# EAGLE schematic DP-webplatformv1.1 (EAGLE 5.06)
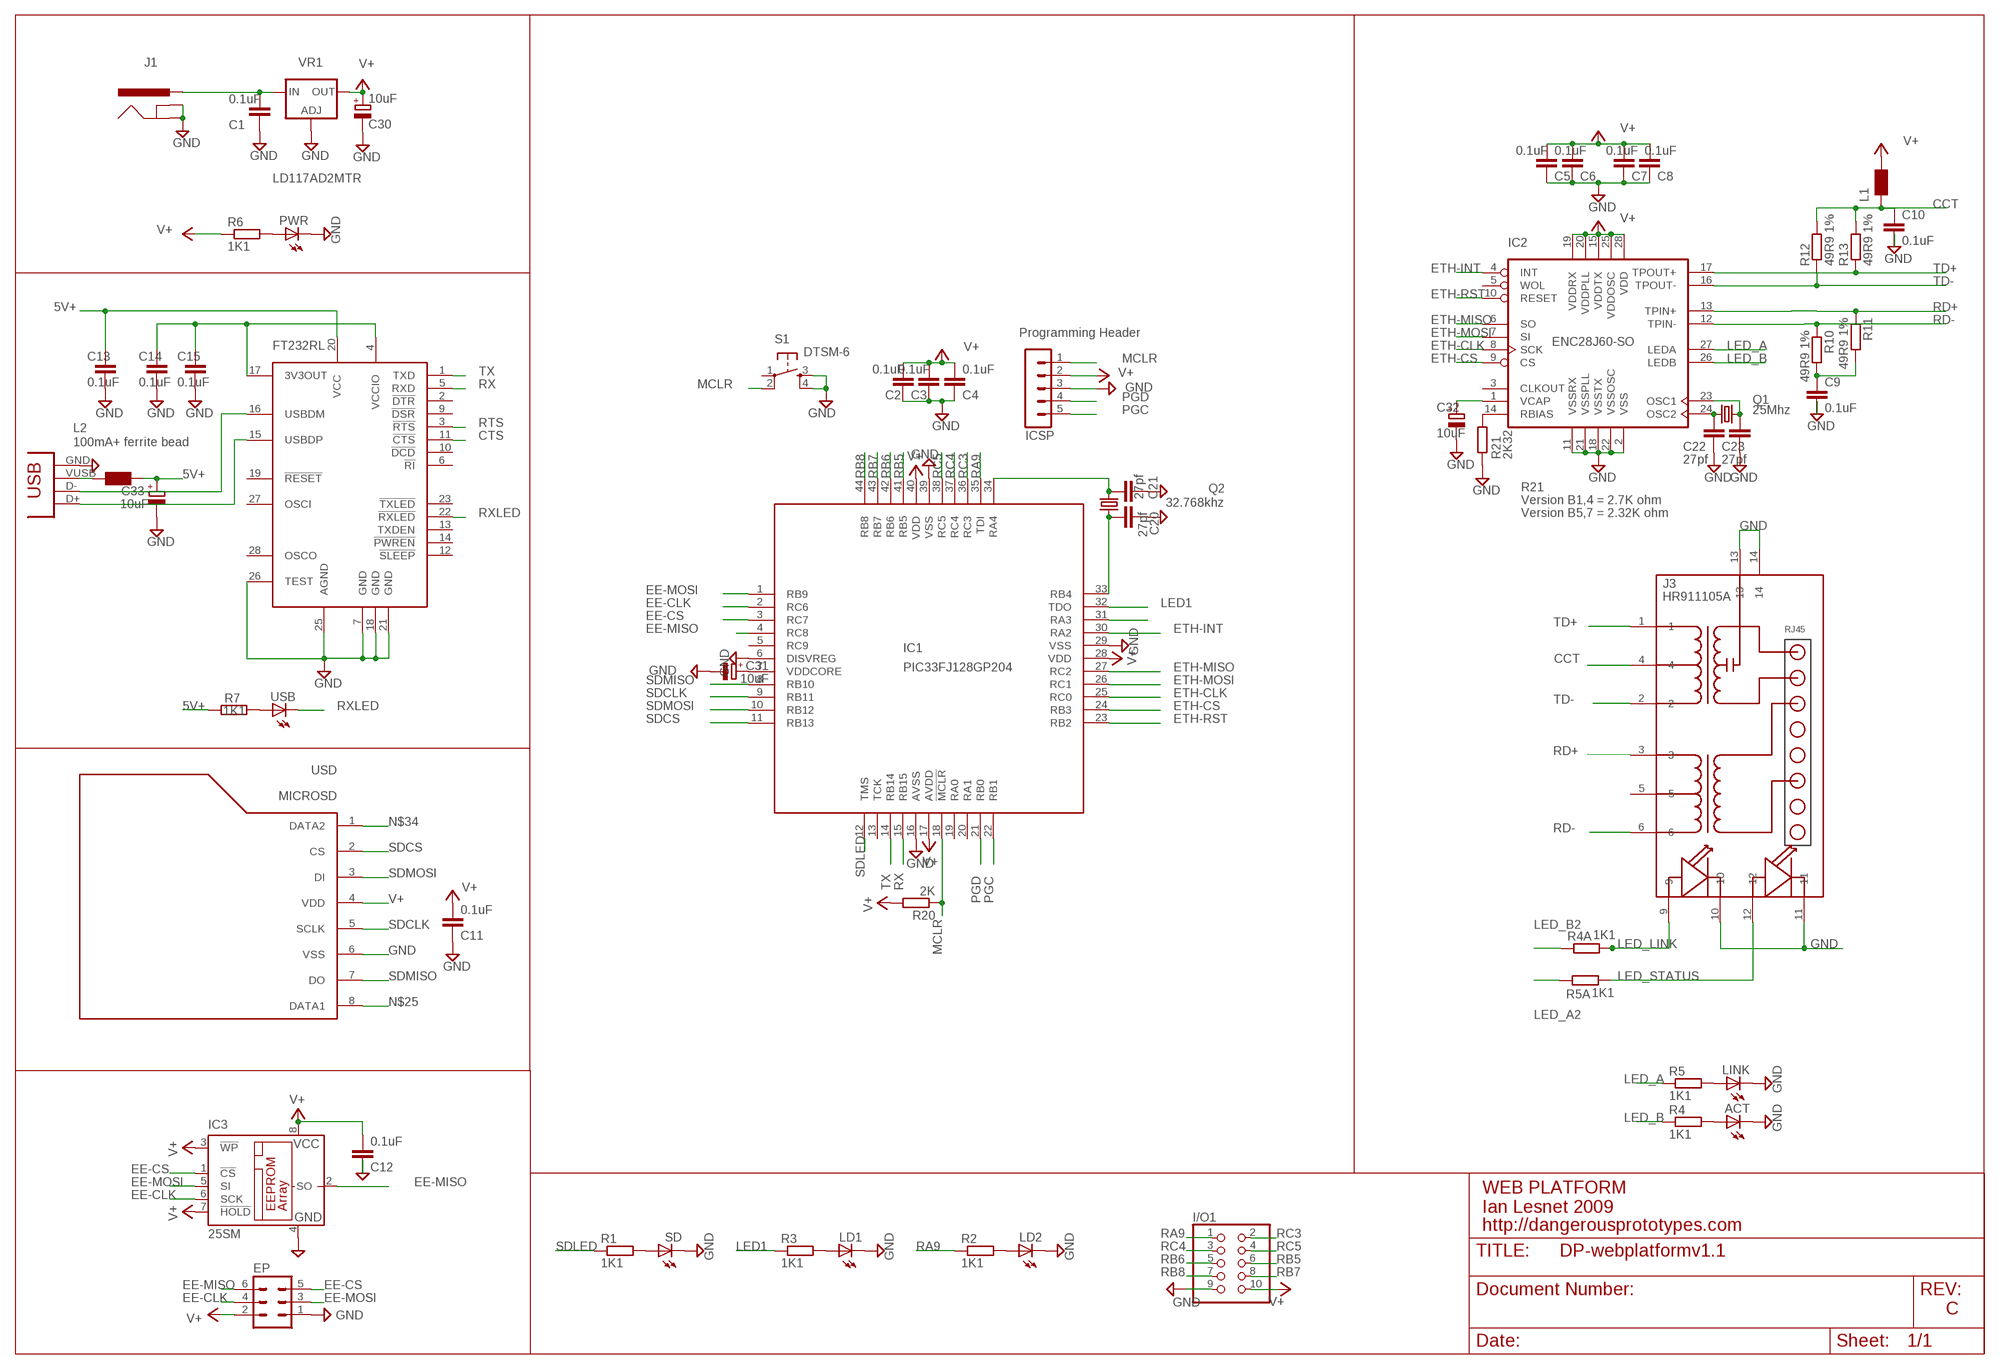
[diagram p0: schematic, sheet 1]

## Parts
ACT  LEDCHIPLED_0805  [CHIPLED_0805]
C1  0.1uF  C-EUC0805  [C0805]
C2  0.1uF  C-EUC0805  [C0805]
C3  0.1uF  C-EUC0805  [C0805]
C4  0.1uF  C-EUC0805  [C0805]
C5  0.1uF  C-EUC0805  [C0805]
C6  0.1uF  C-EUC0805  [C0805]
C7  0.1uF  C-EUC0805  [C0805]
C8  0.1uF  C-EUC0805  [C0805]
C9  0.1uF  C-EUC0805  [C0805]
C10  0.1uF  C-EUC0805  [C0805]
C11  0.1uF  C-EUC0805  [C0805]
C12  0.1uF  C-EUC0805  [C0805]
C13  0.1uF  C-EUC0805  [C0805]
C14  0.1uF  C-EUC0805  [C0805]
C15  0.1uF  C-EUC0805  [C0805]
C20  27pf  C-EUC0805  [C0805]
C21  27pf  C-EUC0805  [C0805]
C22  27pf  C-EUC0805  [C0805]
C23  27pf  C-EUC0805  [C0805]
C30  10uF  CPOL-EUSMCA  [SMC_A]
C31  10uF  CPOL-EUSMCA  [SMC_A]
C32  10uF  CPOL-EUSMCA  [SMC_A]
C33  10uF  CPOL-EUSMCA  [SMC_A]
CONN1  CONN_USB  [CONN_USB_MINI-B]
EP  MA03-2  [MA03-2]
I/O1  PINHD-2X5  [2X05]
IC1  PIC33FJ128GP204  PIC24FJ64GA004  [TQFP44]
IC2  ENC28J60-SO  [SO28W]
IC3  25SM  [SO-08M]
IC4  FT232RL  [SSOP28]
ICSP  MA05-1  [MA05-1]
J1  POWER_JACKSMD  [POWER_JACK_SMD]
J3  HR911105A  [HR911105A]
L1  WE-KIL_0805  [WE-KI_0805_B]
L2  100mA+ ferrite bead  WE-KIL_0805  [WE-KI_0805_B]
LD1  LEDCHIPLED_0805  [CHIPLED_0805]
LD2  LEDCHIPLED_0805  [CHIPLED_0805]
LINK  LEDCHIPLED_0805  [CHIPLED_0805]
PWR  LEDCHIPLED_0805  [CHIPLED_0805]
Q1  25Mhz  CRYSTALHC49UP  [HC49UP]
Q2  32.768khz  CRYSTALMM20SS  [MM20SS]
R1  1K1  R-EU_R0805  [R0805]
R2  1K1  R-EU_R0805  [R0805]
R3  1K1  R-EU_R0805  [R0805]
R4  1K1  R-EU_R0805  [R0805]
R4A  1K1  R-EU_R0805  [R0805]
R5  1K1  R-EU_R0805  [R0805]
R5A  1K1  R-EU_R0805  [R0805]
R6  1K1  R-EU_R0805  [R0805]
R7  1K1  R-EU_M0805  [M0805]
R10  49R9 1%  R-EU_R0805  [R0805]
R11  49R9 1%  R-EU_R0805  [R0805]
R12  49R9 1%  R-EU_R0805  [R0805]
R13  49R9 1%  R-EU_R0805  [R0805]
R20  2K  R-EU_R0805  [R0805]
R21  2K32  R-EU_R0805  [R0805]
S1  DTSM-6  [LSH43]
SD  LEDCHIPLED_0805  [CHIPLED_0805]
USB  LEDCHIP-LED0805  [CHIP-LED0805]
USD  MICROSD  [MICROSD]
VR1  LD117AD2MTR  [D2PACK]

## Nets
5V+: C13.1 C33.+ IC4.20(VCC) L2.1 R7.2
$N26: CONN1.VUSB L2.2
CCT: C10.1 J3.4 L1.2 R12.2 R13.2
CTS: IC4.11(!CTS)
EE-CLK: EP.4 IC1.2(RC6) IC3.6(SCK)
EE-CS: EP.5 IC1.3(RC7) IC3.1(!CS)
EE-MISO: EP.6 IC1.4(RC8) IC3.2(SO)
EE-MOSI: EP.3 IC1.1(RB9) IC3.5(SI)
ETH-CLK: IC1.25(RC0) IC2.8(SCK)
ETH-CS: IC1.24(RB3) IC2.9(CS)
ETH-INT: IC1.30(RA2) IC2.4(INT)
ETH-MISO: IC1.27(RC2) IC2.6(SO)
ETH-MOSI: IC1.26(RC1) IC2.7(SI)
ETH-RST: IC1.23(RB2) IC2.10(RESET)
GND: ACT.C C1.2 C2.2 C3.2 C4.2 C5.2 C6.2 C7.2 C8.2 C9.2 C10.2 C11.2 C12.2 C13.2 C14.2 C15.2 C20.2 C21.2 C22.2 C23.2 C30.- C31.- C32.- C33.- CONN1.GND EP.1 I/O1.9 IC1.6(DISVREG) IC1.16(AVSS) IC1.29(VSS) IC1.39(VSS) IC2.2(VSS) IC2.11(VSSRX) IC2.18(VSSTX) IC2.21(VSSPLL) IC2.22(VSSOSC) IC3.4(GND) IC4.7(GND) IC4.18(GND) IC4.21(GND) IC4.25(AGND) IC4.26(TEST) ICSP.3 J1.GND(GNDBREAK) J1.P$4(GND) J3.10 J3.11 J3.13 J3.14 LD1.C LD2.C LINK.C PWR.C R21.1 S1.3 S1.4 SD.C USD.6(VSS) VR1.1(ADJ)
LED1: IC1.32(TDO) R3.1
LED_A: IC2.27(LEDA) R5.1
LED_A2: R5A.1
LED_B: IC2.26(LEDB) R4.1
LED_B2: R4A.1
LED_LINK: J3.9 R4A.2
LED_STATUS: J3.12 R5A.2
MCLR: IC1.18(!MCLR) ICSP.1 R20.1 S1.2
N$5: C20.1 IC1.33(RB4) Q2.1
N$6: C32.+ IC2.1(VCAP)
N$7: IC2.14(RBIAS) R21.2
N$9: C22.1 IC2.24(OSC2) Q1.1
N$10: R7.1 USB.A
N$11: R1.2 SD.A
N$12: C23.1 IC2.23(OSC1) Q1.2
N$13: LD2.A R2.2
N$14: LINK.A R5.2
N$15: CONN1.D+ IC4.15(USBDP)
N$16: CONN1.D- IC4.16(USBDM)
N$17: C14.1 C15.1 IC4.4(VCCIO) IC4.17(3V3OUT)
N$18: C31.+ IC1.7(VDDCORE)
N$19: C21.1 IC1.34(RA4) Q2.4
N$20: ACT.A R4.2
N$22: C9.1 R10.2 R11.2
N$25: USD.8(DATA1)
N$26: IC1.31(RA3)
N$28: LD1.A R3.2
N$29: PWR.A R6.2
N$34: USD.1(DATA2)
PGC: IC1.22(RB1) ICSP.5
PGD: IC1.21(RB0) ICSP.4
RA9: I/O1.1 IC1.35(TDI) R2.1
RB5: I/O1.6 IC1.41(RB5)
RB6: I/O1.5 IC1.42(RB6)
RB7: I/O1.8 IC1.43(RB7)
RB8: I/O1.7 IC1.44(RB8)
RC3: I/O1.2 IC1.36(RC3)
RC4: I/O1.3 IC1.37(RC4)
RC5: I/O1.4 IC1.38(RC5)
RD+: IC2.13(TPIN+) J3.3 R11.1
RD-: IC2.12(TPIN-) J3.6 R10.1
RTS: IC4.3(!RTS)
RX: IC1.15(RB15) IC4.5(RXD)
RXLED: IC4.22(!RXLED) USB.C
SDCLK: IC1.9(RB11) USD.5(SCLK)
SDCS: IC1.11(RB13) USD.2(CS)
SDLED: IC1.12(TMS) R1.1
SDMISO: IC1.8(RB10) USD.7(DO)
SDMOSI: IC1.10(RB12) USD.3(DI)
TD+: IC2.17(TPOUT+) J3.1 R13.1
TD-: IC2.16(TPOUT-) J3.2 R12.1
TX: IC1.14(RB14) IC4.1(TXD)
V+: C2.1 C3.1 C4.1 C5.1 C6.1 C7.1 C8.1 C11.1 C12.1 C30.+ EP.2 I/O1.10 IC1.17(AVDD) IC1.28(VDD) IC1.40(VDD) IC2.15(VDDTX) IC2.19(VDDRX) IC2.20(VDDPLL) IC2.25(VDDOSC) IC2.28(VDD) IC3.3(!WP) IC3.7(!HOLD) IC3.8(VCC) ICSP.2 L1.1 R6.1 R20.2 USD.4(VDD) VR1.2(OUT)
VBAT: C1.1 J1.VIN0(PWR) VR1.3(IN)
Unconnected: IC1.5(RC9) IC1.13(TCK) IC1.19(RA0) IC1.20(RA1) IC2.3(CLKOUT) IC2.5(WOL) IC4.2(!DTR) IC4.6(!RI) IC4.9(!DSR) IC4.10(!DCD) IC4.12(!SLEEP) IC4.13(TXDEN) IC4.14(!PWREN) IC4.19(!RESET) IC4.23(!TXLED) IC4.27(OSCI) IC4.28(OSCO) J3.5 S1.1

## Notes on the sheet
- J1
- Programming Header
- R21
- Version B1,4 = 2.7K ohm
- Version B5,7 = 2.32K ohm
- WEB PLATFORM
- Ian Lesnet 2009
- http://dangerousprototypes.com
- C

## Library data of the parts
ACT LD1 LD2 LINK PWR SD USB = led:LED: LED OSRAM: - CHIPLED LG R971, LG N971, LY N971, LG Q971, LY Q971, LO R971, LY R971 LH N974, LH R974 LS Q976, LO Q976, LY Q976 LO Q996 - Hyper CHIPLED LW Q18S LB Q993, LB Q99A, LB R99A - SideLED LS A670, LO A670, LY A670, LG A670, LP A670 LB A673, LV A673, LT A673, LW A673 LH A674 LY A675 LS A676, LA A676, LO A676, LY A676, LW A676 LS A679, LY A679, LG A679 - Hyper Micro SIDELED® LS Y876, LA Y876, LO Y876, LY Y876 LT Y87S - SmartLED LW L88C, LW L88S LB L89C, LB L89S, LG L890 LS L89K, LO L89K, LY L89K LS L896, LA L896, LO L896, LY L896 - TOPLED LS T670, LO T670, LY T670, LG T670, LP T670 LSG T670, LSP T670, LSY T670, LOP T670, LYG T670 LG T671, LOG T671, LSG T671 LB T673, LV T673, LT T673, LW T673 LH T674 LS T676, LA T676, LO T676, LY T676, LB T676, LH T676, LSB T676, LW T676 LB T67C, LV T67C, LT T67C, LS T67K, LO T67K, LY T67K, LW E67C LS E67B, LA E67B, LO E67B, LY E67B, LB E67C, LV E67C, LT E67C LW T67C LS T679, LY T679, LG T679 LS T770, LO T770, LY T770, LG T770, LP T770 LB T773, LV T773, LT T773, LW T773 LH T774 LS E675, LA E675, LY E675, LS T675 LS T776, LA T776, LO T776, LY T776, LB T776 LHGB T686 LT T68C, LB T68C - Hyper Mini TOPLED® LB M676 - Mini TOPLED Santana® LG M470 LS M47K, LO M47K, LY M47K Source: http://www.osram.convergy.de LUXEON: - LUMILED® LXK2-PW12-R00, LXK2-PW12-S00, LXK2-PW14-U00, LXK2-PW14-V00 LXK2-PM12-R00, LXK2-PM12-S00, LXK2-PM14-U00 LXK2-PE12-Q00, LXK2-PE12-R00, LXK2-PE12-S00, LXK2-PE14-T00, LXK2-PE14-U00 LXK2-PB12-K00, LXK2-PB12-L00, LXK2-PB12-M00, LXK2-PB14-N00, LXK2-PB14-P00, LXK2-PB14-Q00 LXK2-PR12-L00, LXK2-PR12-M00, LXK2-PR14-Q00, LXK2-PR14-R00 LXK2-PD12-Q00, LXK2-PD12-R00, LXK2-PD12-S00 LXK2-PH12-R00, LXK2-PH12-S00 LXK2-PL12-P00, LXK2-PL12-Q00, LXK2-PL12-R00 Source: www.luxeon.com KINGBRIGHT: KA-3528ASYC Source: www.kingbright.com
C1-C15 C20-C23 = rcl:C-EU: CAPACITOR, European symbol
C30-C33 = rcl:CPOL-EU: POLARIZED CAPACITOR, European symbol
CONN1 = dp_devices:CONN_USB: USB connector
EP = con-lstb:MA03-2: PIN HEADER
I/O1 = pinhead:PINHD-2X5: PIN HEADER
IC1 = microchip:PIC24FJ64GA004: PIC24FJ64GA004 edit this description Auto generated by make-symbol-device-package-bsdl.ulp Rev. 25 Source: PIC24FJ64GA004.bsd
IC2 = microchip-enc28j60:ENC28J60-*: Microchip 10Mbit Eth. contoller with SPI interface
IC3 = microchip:25*: Serial EEPROM 4 K, SPI bus
IC4 = dp_devices:FT232RL: USB to serial UART interface
ICSP = con-lstb:MA05-1: PIN HEADER
J1 = SparkFun:POWER_JACK: Power Jack This is the standard 5.5mm barrel jack for power. The PTH is the most common, proven, reliable, footprint. All others are experimental. The Slot footprint only works if the mill layer is transmitted to the PCB fab house so be warned. Spark Fun Electronics SKU : PRT-00119. Mating wall wart : TOL-00298 (and others)
J3 = CONNECTER:HR911105A
L1 L2 = wuerth-elektronik:WE-KIL: SMD Wire Wound Ceramic Inductor WE-KIL - Low profile - High Q values -- Bluetooth -- Wireless LAN -- RF oscillation circuit -- IF impedance matching
Q1 Q2 = crystal:CRYSTAL: CRYSTAL
R1-R4 R4A R5 R5A R6 R10-R13 R20 R21 = rcl:R-EU_: RESISTOR, European symbol
R7 = resistor:R-EU_: RESISTOR, European symbol
S1 = switch-tact:DTSM-6
USD = Seeed:MICROSD
VR1 = v-reg:LD117A?*: Low drop fixed and adjustable positive voltage regulators 1 A Source: http://www.st.com/stonline/products/literature/ds/7194/ld1117axx.pdf